# Altium schematic sheet Tray2_Comms_SwC.SchDoc: BLUEsat Switching Circuit Overview
size A3; Engineer: D. JEDRYCHOWSKI; Organization: BLUEsat Project; Address1: Room 419; Address2: School of EE&T; Address3: UNSW, NSW 2052; Address4: Australia; DocumentNumber: COMS0004; SheetNumber: 1; SheetTotal: 4; Description: Overview of Switching Circuit; Version: 1.0
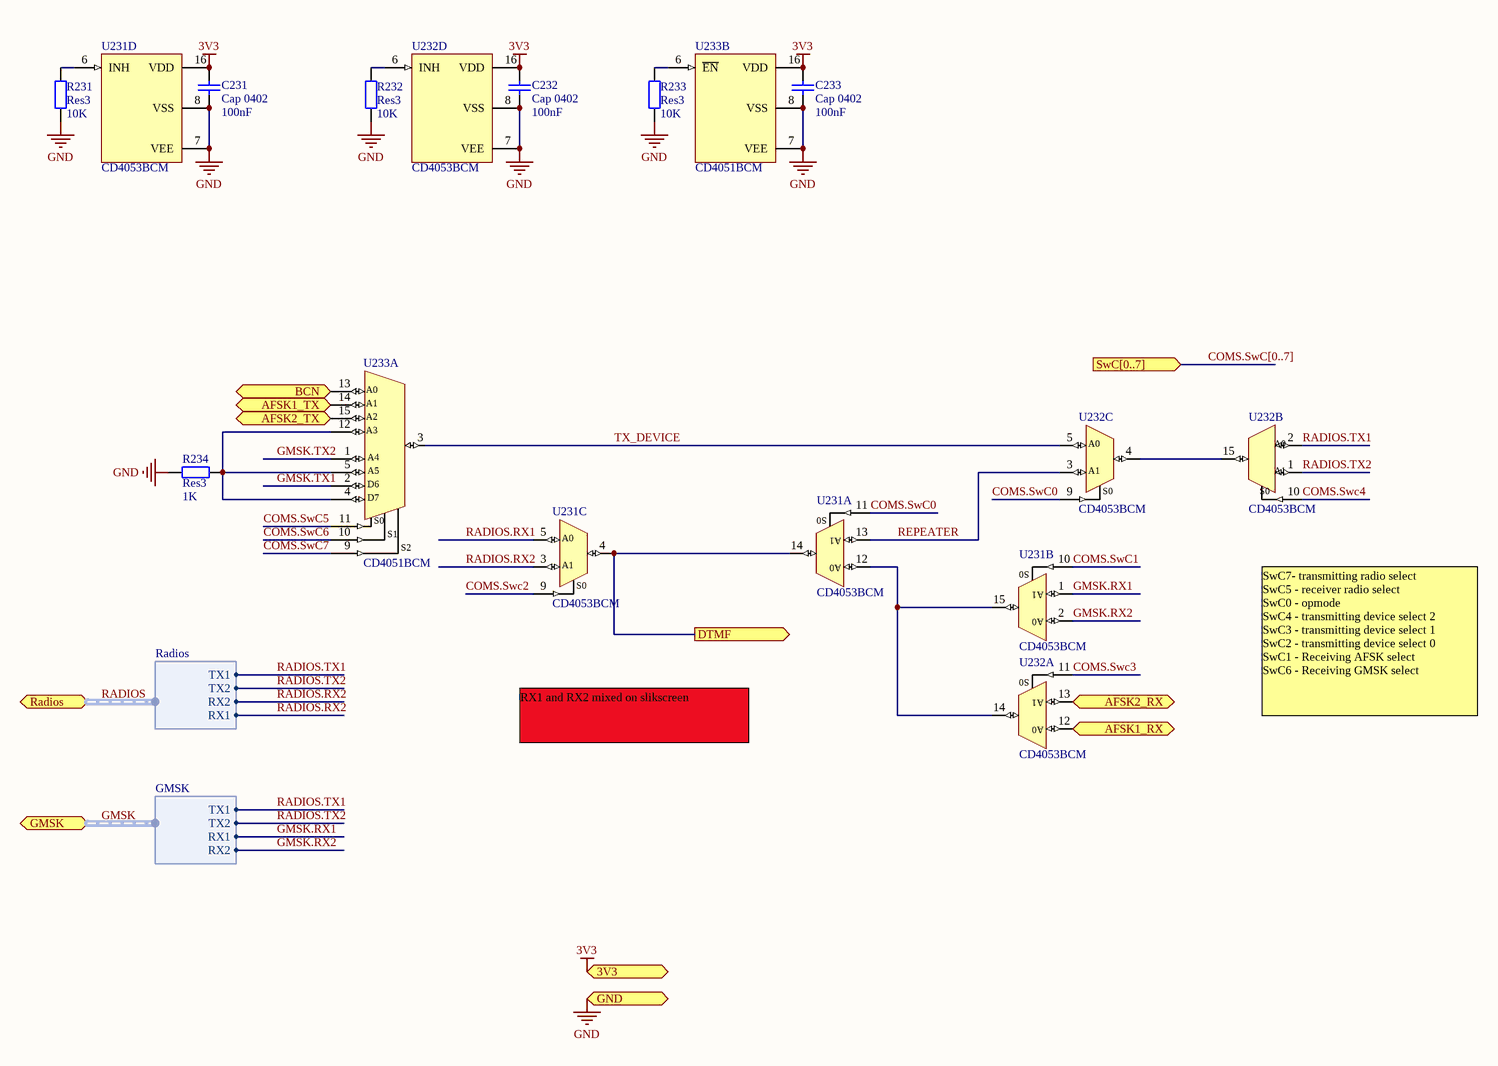
[diagram p0: Tray2_Comms_SwC.SchDoc]

## Parts
C231  Cap 0402  value 100nF  [CAPC1005X06L]
C232  Cap 0402  value 100nF  [CAPC1005X06L]
C233  Cap 0402  value 100nF  [CAPC1005X06L]
R231  Res3  value 10K  [RESC1005X06L]
R232  Res3  value 10K  [RESC1005X06L]
R233  Res3  value 10K  [RESC1005X06L]
R234  Res3  value 1K  [RESC1005X06L]
U231  CD4053BCM  [TSSOP16]  (parts A,B,C,D of 4)
U232  CD4053BCM  [TSSOP16]  (parts A,B,C,D of 4)
U233  CD4051BCM  [TSSOP16]  (parts A,B of 2)

## Ports
3V3 (in), AFSK1_RX (out), AFSK1_TX (in), AFSK2_RX (out), AFSK2_TX (in), BCN (in), DTMF (out), GMSK (harness GMSK), GND (in), Radios (harness Radios), SwC[0..7] (in)

## Harnesses
Radios: RX1, RX2, TX1, TX2
GMSK: RX1, RX2, TX1, TX2

## Nets
3V3: C231.2 C232.2 C233.2 U231.16(VDD) U232.16(VDD) U233.16(VDD) ; port 3V3
GND: C231.1 C232.1 C233.1 R231.2 R232.2 R233.2 R234.1 U231.7(VEE) U231.8(VSS) U232.7(VEE) U232.8(VSS) U233.7(VEE) U233.8(VSS) ; port GND
AFSK1_RX: U232.12(A0) ; port AFSK1_RX
AFSK1_TX: U233.14(A1) ; port AFSK1_TX
AFSK2_RX: U232.13(A1) ; port AFSK2_RX
AFSK2_TX: U233.15(A2) ; port AFSK2_TX
BCN: U233.13(A0) ; port BCN
COMS.SwC0: U231.11(A) U232.9(C)
COMS.SwC1: U231.10(B)
COMS.Swc2: U231.9(C)
COMS.Swc3: U232.11(A)
COMS.Swc4: U232.10(B)
COMS.SwC5: U233.11(S0)
COMS.SwC6: U233.10(S1)
COMS.SwC7: U233.9(S2)
DTMF: U231.4(c_out) U231.14(A_out) ; port DTMF
GMSK.RX1: U231.1(by) ; port GMSK.RX1
GMSK.RX2: U231.2(bx) ; port GMSK.RX2
GMSK.TX1: U233.2(A6)
GMSK.TX2: U233.1(A4)
RADIOS.RX1: U231.5(cx)
RADIOS.RX2: U231.3(cy) ; port Radios.RX1, port Radios.RX2  [project net RADIOS.RX1]
RADIOS.TX1: U232.2(bx) ; port Radios.TX1, port GMSK.TX1  [project net GMSK.TX1]
RADIOS.TX2: U232.1(by) ; port Radios.TX2, port GMSK.TX2  [project net GMSK.TX2]
REPEATER: U231.13(A1) U232.3(cy)
TX_DEVICE: U232.5(cx) U233.3(O)
NetR231_1: R231.1 U231.6(INH)
NetR232_1: R232.1 U232.6(INH)
NetR233_1: R233.1 U233.6(~{EN})
NetR234_2: R234.2 U233.4(A7) U233.5(A5) U233.12(A3)
NetU231_12: U231.12(A0) U231.15(b_out) U232.14(A_out)
NetU232_4: U232.4(c_out) U232.15(b_out)

## Buses and harness runs
bus COMS.SwC[0..7] = port SwC[0..7]
harness GMSK = port GMSK
harness RADIOS = port Radios

## Notes on the sheet
- RX1 and RX2 mixed on slikscreen
- SwC7- transmitting radio select
  SwC5 - receiver radio select
  SwC0 - opmode
  SwC4 - transmitting device select 2
  SwC3 - transmitting device select 1
  SwC2 - transmitting device select 0
  SwC1 - Receiving AFSK select
  SwC6 - Receiving GMSK select
- Title
- Description:
- Size:
- Author:
- Date:
- A3
- Time:
- Version
- Sheet:
- Drawing No.:
- of
- File:
- (in symbol CD4051BCM, part A) D6; D7
- (in symbol CD4053BCM, part A) S0
- (in symbol CD4053BCM, part B) S0
- (in symbol CD4053BCM, part C) S0

## Library data of the parts
C231-C233 = Cap 0402: Capacitor; Published: 8-Jun-2000; LatestRevisionDate: 17-Jul-2002; LatestRevisionNote: Re-released for DXP Platform.; PackageReference: RAD-0.3; Publisher: Altium Limited; PackageDescription: Radial Cap, Thru-Hole; 2 Leads; 0.3 in Pin Spacing
R231-R234 = Res3: Resistor; Published: 8-Jun-2000; LatestRevisionDate: 29-May-2009; LatestRevisionNote: IPC-7351 Footprint Added.; PackageReference: J1-0603; Publisher: Altium Limited; PackageDescription: Chip Resistor
U231 U232 = CD4053BCM: Triple 2-Channnel Analog Multiplexer/Demutiplexer; Supplier 1: Farnell; Supplier Part Number 1: 2132284
U233 = CD4051BCM: 8-Channel Analog Multiplexer/Demultiplexer; Datasheet Link: http://focus.ti.com/lit/ds/symlink/cd4052b.pdf; Supplier 1: Farnell; Supplier Part Number 1: 1753421